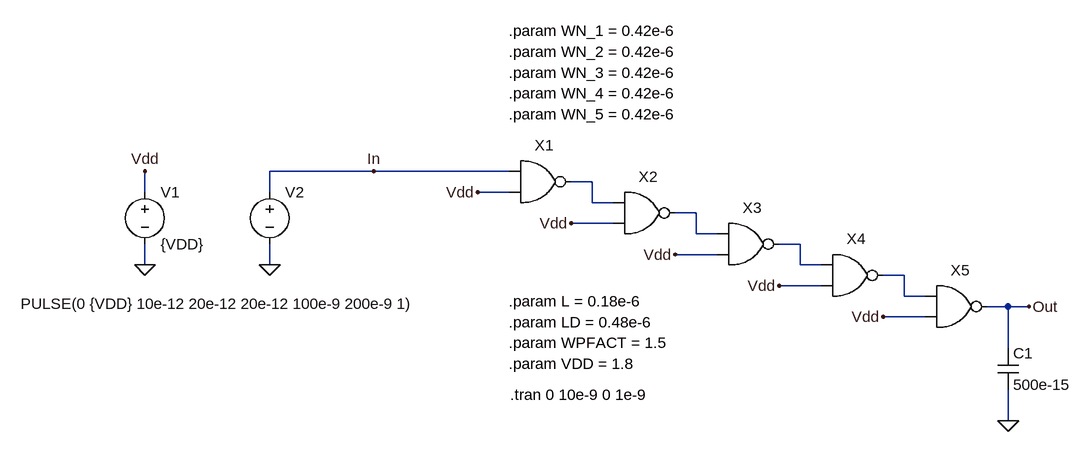
[diagram p0: schematic nand_chain_5.asc]
nand_chain_5.asc, the LTspice schematic file:
Version 4
SHEET 1 2644 1704
WIRE 992 208 832 208
WIRE 1200 208 992 208
WIRE 1328 224 1296 224
WIRE 640 240 640 208
WIRE 832 240 832 208
WIRE 1200 240 1152 240
WIRE 1328 256 1328 224
WIRE 1360 256 1328 256
WIRE 1488 272 1456 272
WIRE 1360 288 1296 288
WIRE 1488 304 1488 272
WIRE 1520 304 1488 304
WIRE 1648 320 1616 320
WIRE 1520 336 1456 336
WIRE 640 352 640 320
WIRE 832 352 832 320
WIRE 1648 352 1648 320
WIRE 1680 352 1648 352
WIRE 1808 368 1776 368
WIRE 1680 384 1616 384
WIRE 1808 400 1808 368
WIRE 1840 400 1808 400
WIRE 1968 416 1936 416
WIRE 2000 416 1968 416
WIRE 1840 432 1776 432
WIRE 1968 480 1968 416
WIRE 1968 592 1968 544
FLAG 992 208 In
FLAG 640 352 0
FLAG 640 208 Vdd
FLAG 832 352 0
FLAG 2000 416 Out
FLAG 1968 592 0
FLAG 1152 240 Vdd
FLAG 1296 288 Vdd
FLAG 1456 336 Vdd
FLAG 1616 384 Vdd
FLAG 1776 432 Vdd
SYMBOL voltage 640 224 R0
WINDOW 123 0 0 Left 0
WINDOW 39 0 0 Left 0
SYMATTR InstName V1
SYMATTR Value {VDD}
SYMBOL voltage 832 224 R0
WINDOW 123 0 0 Left 0
WINDOW 39 0 0 Left 0
WINDOW 3 -383 188 Left 2
SYMATTR Value PULSE(0 {VDD} 10e-12 20e-12 20e-12 100e-9 200e-9 1)
SYMATTR InstName V2
SYMBOL nand 1248 160 R0
SYMATTR InstName X1
SYMATTR SpiceLine VDD={VDD} L={L} LD={LD} WN={WN_1} WPFACT={WPFACT}
SYMBOL nand 1408 208 R0
SYMATTR InstName X2
SYMATTR SpiceLine VDD={VDD} L={L} LD={LD} WN={WN_2} WPFACT={WPFACT}
SYMBOL nand 1568 256 R0
SYMATTR InstName X3
SYMATTR SpiceLine VDD={VDD} L={L} LD={LD} WN={WN_3} WPFACT={WPFACT}
SYMBOL nand 1728 304 R0
SYMATTR InstName X4
SYMATTR SpiceLine VDD={VDD} L={L} LD={LD} WN={WN_4} WPFACT={WPFACT}
SYMBOL nand 1888 352 R0
SYMATTR InstName X5
SYMATTR SpiceLine VDD={VDD} L={L} LD={LD} WN={WN_5} WPFACT={WPFACT}
SYMBOL cap 1952 480 R0
SYMATTR InstName C1
SYMATTR Value 500e-15
TEXT 1200 56 Left 2 !.param WN_3 = 0.42e-6
TEXT 1200 88 Left 2 !.param WN_4 = 0.42e-6
TEXT 1200 -8 Left 2 !.param WN_1 = 0.42e-6
TEXT 1200 24 Left 2 !.param WN_2 = 0.42e-6
TEXT 1200 120 Left 2 !.param WN_5 = 0.42e-6
TEXT 1202 552 Left 2 !.tran 0 10e-9 0 1e-9
TEXT 1200 408 Left 2 !.param L = 0.18e-6
TEXT 1200 440 Left 2 !.param LD = 0.48e-6
TEXT 1200 504 Left 2 !.param VDD = 1.8
TEXT 1200 472 Left 2 !.param WPFACT = 1.5

The netlist it stands for:
* nand_chain_5.asc
V1 Vdd 0 {VDD}
V2 In 0 PULSE(0 {VDD} 10e-12 20e-12 20e-12 100e-9 200e-9 1)
XX1 In Vdd N001 nand VDD={VDD} L={L} LD={LD} WN={WN_1} WPFACT={WPFACT}  ; pins A B OUT
XX2 N001 Vdd N002 nand VDD={VDD} L={L} LD={LD} WN={WN_2} WPFACT={WPFACT}  ; pins A B OUT
XX3 N002 Vdd N003 nand VDD={VDD} L={L} LD={LD} WN={WN_3} WPFACT={WPFACT}  ; pins A B OUT
XX4 N003 Vdd N004 nand VDD={VDD} L={L} LD={LD} WN={WN_4} WPFACT={WPFACT}  ; pins A B OUT
XX5 N004 Vdd Out nand VDD={VDD} L={L} LD={LD} WN={WN_5} WPFACT={WPFACT}  ; pins A B OUT
C1 Out 0 500e-15
.param WN_3 = 0.42e-6
.param WN_4 = 0.42e-6
.param WN_1 = 0.42e-6
.param WN_2 = 0.42e-6
.param WN_5 = 0.42e-6
.tran 0 10e-9 0 1e-9
.param L = 0.18e-6
.param LD = 0.48e-6
.param VDD = 1.8
.param WPFACT = 1.5
.backanno
.end